# Altium schematic sheet OpenPack_BATMOD_V2p0_CHRG.SchDoc
size A4; SheetNumber: 5; SheetTotal: 9; Title_: Battery Charger
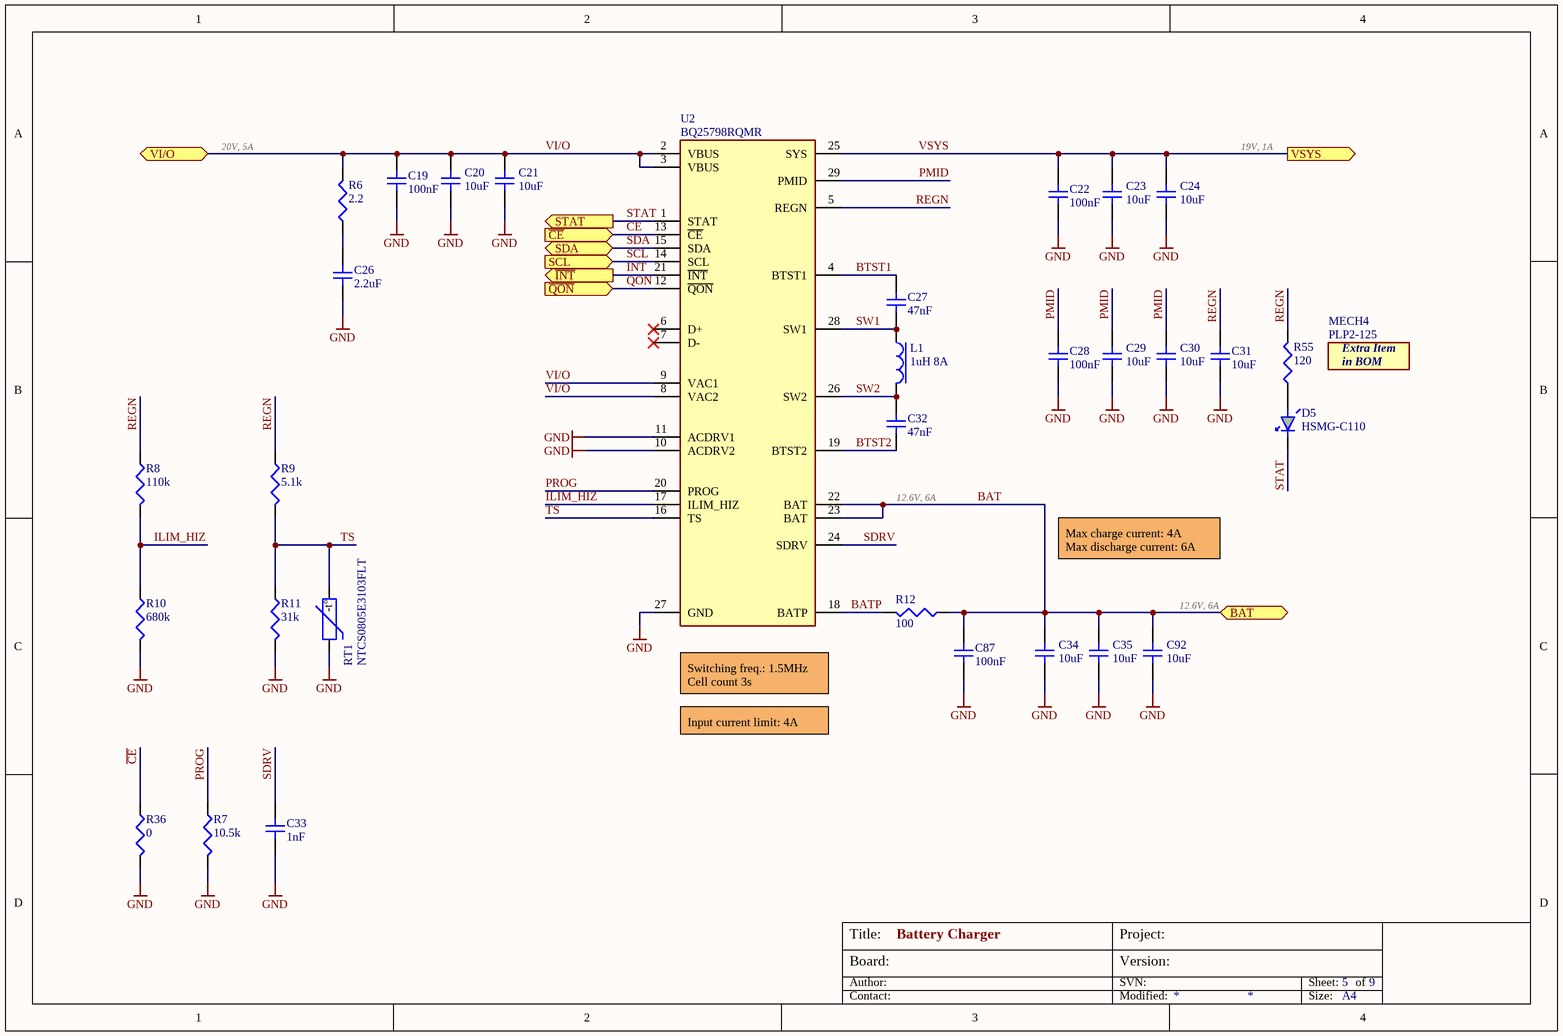
[diagram p0: OpenPack_BATMOD_V2p0_CHRG.SchDoc]

## Parts
C19  100nF  [CAP_0603]
C20  10uF  [CAP_1210]
C21  10uF  [CAP_1210]
C22  100nF  [CAP_0603]
C23  10uF  [CAP_1210]
C24  10uF  [CAP_1210]
C26  2.2uF  [CAP-0805]
C27  47nF  [CAP_0603]
C28  100nF  [CAP_0603]
C29  10uF  [CAP_1210]
C30  10uF  [CAP_1210]
C31  10uF  [CAP_0603]
C32  47nF  [CAP_0603]
C33  1nF  [CAP_0603]
C34  10uF  [CAP_1210]
C35  10uF  [CAP_1210]
C87  100nF  [CAP_0603]
C92  10uF  [CAP_1210]
D5  HSMG-C110  [LED_SMD_90DEG_GRE]
L1  1uH 8A  [WE-LHMI_7030]
MECH4  PLP2-125  (mechanical)
R6  2.2  [RES-0805]
R7  10.5k  [RES-0603]
R8  110k  [RES-0603]
R9  5.1k  [RES-0603]
R10  680k  [RES-0603]
R11  31k  [RES-0603]
R12  100  [RES-0603]
R36  0  [RES-0603]
R55  120  [RES-0603]
RT1  NTCS0805E3103FLT  [RES-0805]
U2  BQ25798RQMR  [QFN 29]

## Ports
BAT (bidir, see OpenPack_BATMOD_V2p0_MAIN, OpenPack_BATMOD_V2p0_BAT), SCL (in, see OpenPack_BATMOD_V2p0_MAIN), SDA (bidir, see OpenPack_BATMOD_V2p0_MAIN), STAT (out, see OpenPack_BATMOD_V2p0_MAIN, OpenPack_BATMOD_V2p0_MCU), VI/O (bidir, see OpenPack_BATMOD_V2p0_MAIN, OpenPack_BATMOD_V2p0_MAN), VSYS (out, see OpenPack_BATMOD_V2p0_MAIN, OpenPack_BATMOD_V2p0_PWR, OpenPack_BATMOD_V2p0_USBA), ~{CE} (in, see OpenPack_BATMOD_V2p0_MAIN, OpenPack_BATMOD_V2p0_MCU), ~{INT} (out, see OpenPack_BATMOD_V2p0_MAIN, OpenPack_BATMOD_V2p0_MCU), ~{QON} (in, see OpenPack_BATMOD_V2p0_MAIN, OpenPack_BATMOD_V2p0_MCU)

## Nets
GND: C19.1 C20.1 C21.1 C22.1 C23.1 C24.1 C26.1 C28.1 C29.1 C30.1 C31.1 C33.1 C34.1 C35.1 C87.1 C92.1 R7.2 R10.2 R11.2 R36.2 RT1.1 U2.10(ACDRV2) U2.11(ACDRV1) U2.27(GND)
BAT: C34.2 C35.2 C87.2 C92.2 R12.1 U2.22(BAT) U2.23(BAT) ; port BAT
BATP: R12.2 U2.18(BATP)
BTST1: C27.2 U2.4(BTST1)
BTST2: C32.1 U2.19(BTST2)
~{CE}: R36.1 U2.13(~{CE}) ; port ~{CE}
~{INT}: U2.21(~{INT}) ; port ~{INT}
ILIM_HIZ: R8.2 R10.1 U2.17(ILIM_HIZ)
PMID: C28.2 C29.2 C30.2 U2.29(PMID)
PROG: R7.1 U2.20(PROG)
~{QON}: U2.12(~{QON}) ; port ~{QON}
REGN: C31.2 R8.1 R9.1 R55.1 U2.5(REGN)
SCL: U2.14(SCL) ; port SCL
SDA: U2.15(SDA) ; port SDA
SDRV: C33.2 U2.24(SDRV)
STAT: D5.K U2.1(STAT) ; port STAT
SW1: C27.1 L1.1 U2.28(SW1)
SW2: C32.2 L1.2 U2.26(SW2)
TS: R9.2 R11.1 RT1.2 U2.16(TS)
VI/O: C19.2 C20.2 C21.2 R6.2 U2.2(VBUS) U2.3(VBUS) U2.8(VAC2) U2.9(VAC1) ; port VI/O
VSYS: C22.2 C23.2 C24.2 U2.25(SYS) ; port VSYS
NetC26_2: C26.2 R6.1
NetD5_A: D5.A R55.2

Not connected (* = marked no-connect by the designer): U2 6(D+)* 7(D-)*

## Notes on the sheet
- 20V, 5A
- 19V, 1A
- 12.6V, 6A
- Max charge current: 4A
  Max discharge current: 6A
- (near C92) 12.6V, 6A
- (near U2) Switching freq.: 1.5MHz
  Cell count 3s
- Input current limit: 4A
- Board:
- Author:
- Title:
- Project:
- SVN:
- Version:
- Sheet:
- of
- Contact:
- Modified:
- Size:
- A4
- (in symbol NTCS0805E3103FLT) -t°
- (in symbol PLP2-125) Extra Item; in BOM

## Library data of the parts
C19 C22 C26-C28 C31-C33 C87 = NP-CAPACITOR: MLCC capacitor; Type: CAP
C20 C21 C23 C24 C29 C30 C34 C35 C92 = NP-CAPACITOR: UMK325BJ106KM-P; Part number: 810-CGA6P1X7R1N106K2; Type: CAP; Supplier: Mouser
D5 = HSMG-C110: Green LED, 90deg; Part number: 630-HSMG-C110; Type: Diode; ComponentLink1Description: Datasheet; ComponentLink1URL: AV02_0551EN_DS_HSMx_Cxxx.pdf; Supplier: Mouser; ComponentLink2Description: Order; ComponentLink2URL: https://hu.mouser.com/ProductDetail/Broadcom-Avago/HSMG-C110?qs=YDL0qNrpDT4yGVa8S%252B44dw%3D%3D
L1 = Inductance - 1uH: Ferrit core coil, 1uH 8A, 10mR; Part number: 710-74437346010; Type: IND; Supplier: Mouser; ComponentLink1Description: Datasheet; ComponentLink2Description: Order; ComponentLink2URL: https://hu.mouser.com/en/ProductDetail/Wurth-Elektronik/74437346010?qs=cFlH0mFHHFoJDXer0S4nbw%3D%3D
MECH4 = PLP2-125: LED Light Pipe, 3mm round lense; Part number: 749-PLP2-125; Type: MECH; Supplier: Mouser; ComponentLink1Description: Datasheet; ComponentLink1URL: PLP2_XXX-3001748.pdf; ComponentLink2Description: Order; ComponentLink2URL: https://hu.mouser.com/ProductDetail/Bivar/PLP2-125?qs=6qR8IwHvvodoR2yuSMLqUA%3D%3D
R6-R12 R36 R55 = RESISTOR: Metal Film Resistor; Type: RES
RT1 = NTCS0805E3103FLT: NTC (Negative Temperature Coefficient) Thermistors 10Kohms 1%; Part number: 594-NTCS0805E3103FLT; Supplier: Mouser; Type: RES; ComponentLink1Description: Datasheet; ComponentLink2Description: Order; ComponentLink2URL: https://hu.mouser.com/en/ProductDetail/Vishay-BC-Components/NTCS0805E3103FLT?qs=%2FWiulJ9oly4Pd4lidS66Yw%3D%3D
U2 = BQ25798RQMR: Battery Management I C controlled 1-4- cell 5-A buck-boost; Part number: 595-BQ25798RQMR; ComponentLink1Description: Datasheet; Supplier: Mouser; ComponentLink2Description: Order; ComponentLink2URL: https://hu.mouser.com/en/ProductDetail/Texas-Instruments/BQ25798RQMR?qs=ljCeji4nMDmr66dwAbNsCg%3D%3D; Type: IC